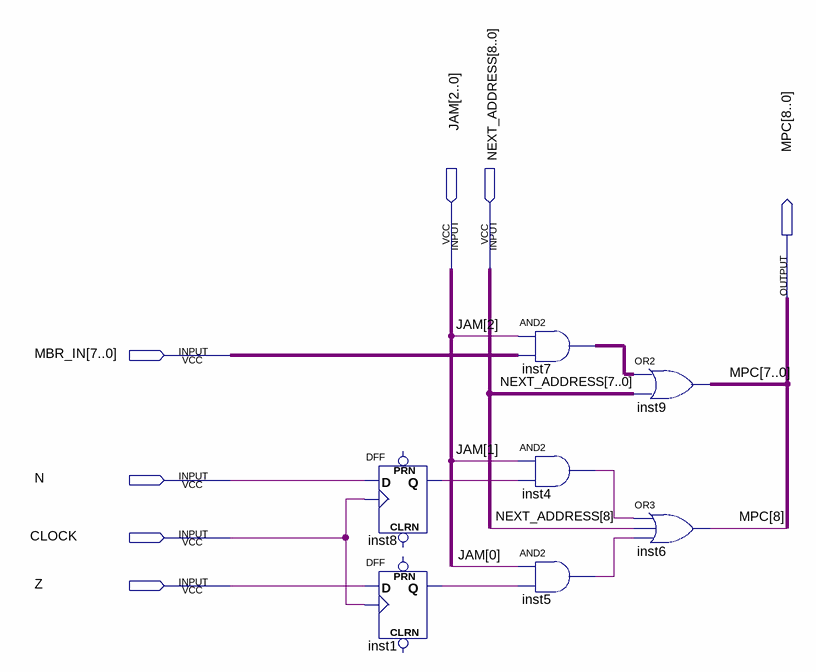
[diagram p0: schematic sheet]
// Quartus schematic MPC_GENERATOR.bdf as structural Verilog: 7 symbols, 7 pins
module MPC_GENERATOR (
  input  [2:0] JAM,
  input  [8:0] NEXT_ADDRESS,
  input  [7:0] MBR_IN,
  input  N,
  input  CLOCK,
  input  Z,
  output [8:0] MPC
);

  wire inst1_q, inst4_out, inst5_out, inst8_q;
  wire [7:0] inst7_out;

  DFF inst8 (.CLK(CLOCK), .D(N), .Q(inst8_q));  // open: CLRN, PRN
  DFF inst1 (.CLK(CLOCK), .D(Z), .Q(inst1_q));  // open: CLRN, PRN
  assign inst7_out = {8{JAM[2]}} & MBR_IN;  // AND2 inst7, 8 bits wide
  and inst4 (inst4_out, JAM[1], inst8_q);
  and inst5 (inst5_out, JAM[0], inst1_q);
  assign MPC[7:0] = inst7_out | NEXT_ADDRESS[7:0];  // OR2 inst9, 8 bits wide
  or inst6 (MPC[8], inst4_out, NEXT_ADDRESS[8], inst5_out);
endmodule
